# Altium schematic sheet MEMORY.SchDoc
size A4
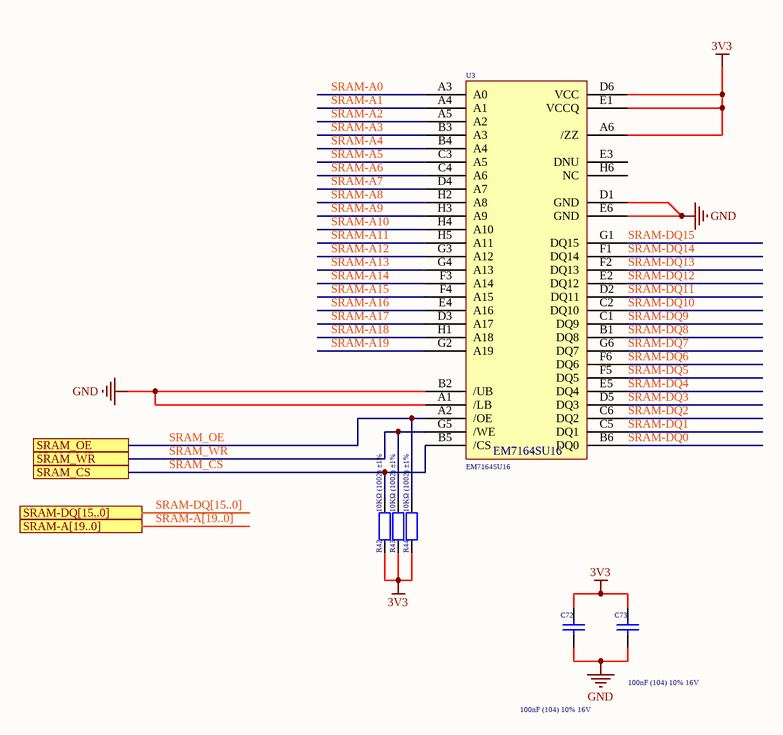
[diagram p0: MEMORY.SchDoc]

## Parts
C72  100nF (104) 10% 16V  [0402_C]
C73  100nF (104) 10% 16V  [0402_C]
R42  10KΩ (1002) ±1%  [0402_R]
R43  10KΩ (1002) ±1%  [0402_R]
R44  10KΩ (1002) ±1%  [0402_R]
U3  EM7164SU16  [BGA48C75P6X8_598X698X104]

## Ports
SRAM-A[19..0], SRAM-DQ[15..0], SRAM_CS, SRAM_OE, SRAM_WR

## Nets
3V3: C72.2 C73.2 R42.1 R43.1 R44.1 U3.A6(/ZZ) U3.D6(VCC) U3.E1(VCCQ)
GND: C72.1 C73.1 U3.A1(/LB) U3.B2(/UB) U3.D1(GND) U3.E6(GND)
SRAM-A0: U3.A3(A0)
SRAM-A1: U3.A4(A1)
SRAM-A2: U3.A5(A2)
SRAM-A3: U3.B3(A3)
SRAM-A4: U3.B4(A4)
SRAM-A5: U3.C3(A5)
SRAM-A6: U3.C4(A6)
SRAM-A7: U3.D4(A7)
SRAM-A8: U3.H2(A8)
SRAM-A9: U3.H3(A9)
SRAM-A10: U3.H4(A10)
SRAM-A11: U3.H5(A11)
SRAM-A12: U3.G3(A12)
SRAM-A13: U3.G4(A13)
SRAM-A14: U3.F3(A14)
SRAM-A15: U3.F4(A15)
SRAM-A16: U3.E4(A16)
SRAM-A17: U3.D3(A17)
SRAM-A18: U3.H1(A18)
SRAM-A19: U3.G2(A19)
SRAM-DQ0: U3.B6(DQ0)
SRAM-DQ1: U3.C5(DQ1)
SRAM-DQ2: U3.C6(DQ2)
SRAM-DQ3: U3.D5(DQ3)
SRAM-DQ4: U3.E5(DQ4)
SRAM-DQ5: U3.F5(DQ5)
SRAM-DQ6: U3.F6(DQ6)
SRAM-DQ7: U3.G6(DQ7)
SRAM-DQ8: U3.B1(DQ8)
SRAM-DQ9: U3.C1(DQ9)
SRAM-DQ10: U3.C2(DQ10)
SRAM-DQ11: U3.D2(DQ11)
SRAM-DQ12: U3.E2(DQ12)
SRAM-DQ13: U3.F2(DQ13)
SRAM-DQ14: U3.F1(DQ14)
SRAM-DQ15: U3.G1(DQ15)
SRAM_CS: R42.2 U3.B5(/CS) ; port SRAM_CS
SRAM_OE: R44.2 U3.A2(/OE) ; port SRAM_OE
SRAM_WR: R43.2 U3.G5(/WE) ; port SRAM_WR

Not connected (* = marked no-connect by the designer): U3 E3(DNU) H6(NC)

## Buses and harness runs
bus SRAM-A[19..0] = port SRAM-A[19..0]
bus SRAM-DQ[15..0] = port SRAM-DQ[15..0]

## Library data of the parts
C72 C73 = 0402 100nF (104) 10% 16V: 贴片电容; ComponentLink1Description: 供应商链接; ComponentLink1URL: http://www.szlcsc.com/product/details_1877.html; Package: 0402; Supplier: LC; SuppliersPartNumber: C1525
R42-R44 = 0402 10KΩ (1002) 1%: 贴片电阻; ComponentLink1Description: 供应商链接; ComponentLink1URL: http://www.szlcsc.com/product/details_26487.html; Package: 0402; Supplier: LC; SuppliersPartNumber: C25744